# EAGLE design cemu-aux (EAGLE 5.07)
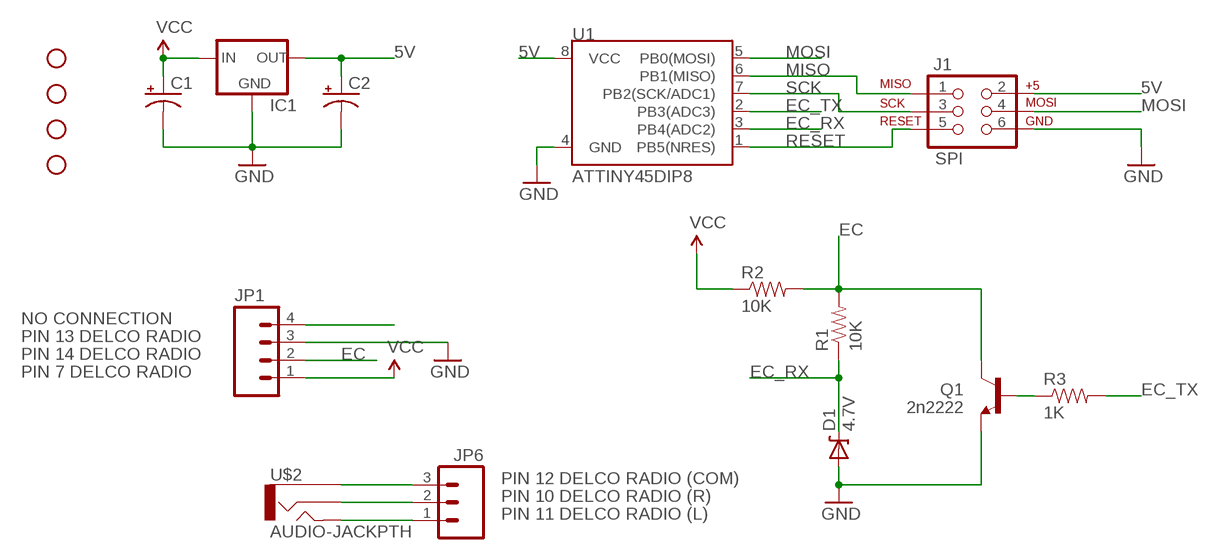
[diagram p0: schematic, sheet 1]

## Parts
C1  CAP_POLPTH1  [CPOL-RADIAL-100UF-25V]
C2  CAP_POLPTH1  [CPOL-RADIAL-100UF-25V]
D1  4.7V  DIODE-ZENERPTH  [DIODE-ZENER]
IC1  V_REG_78XXSIDE  [78XXL]
J1  SPI  AVR_SPI_PRG_6PTH  [2X3]
JP1  M04POLAR  [MOLEX-1X4]
JP2  STAND-OFF  [STAND-OFF]
JP3  STAND-OFF  [STAND-OFF]
JP4  STAND-OFF  [STAND-OFF]
JP5  STAND-OFF  [STAND-OFF]
JP6  M03POLAR  [MOLEX-1X3]
Q1  2n2222  TRANSISTOR_NPNTO92  [TO-92]
R1  10K  RESISTORPTH1  [AXIAL-0.3]
R2  10K  RESISTORPTH1  [AXIAL-0.3]
R3  1K  RESISTORPTH1  [AXIAL-0.3]
U1  ATTINY45DIP8  [DIP08]
U$2  AUDIO-JACKPTH  [AUDIO-JACK]

## Nets
5V: C2.1(+) IC1.OUT J1.2 U1.8(VCC)
EC: JP1.2 Q1.3(C) R1.P$2 R2.P$2
EC_RX: D1.P$1(C) R1.P$1 U1.3(PB4(ADC2))
EC_TX: R3.P$2 U1.2(PB3(ADC3))
GND: C1.2(-) C2.2(-) D1.P$2(A) IC1.GND J1.6 JP1.3 Q1.1(E) U1.4(GND)
MISO: J1.1 U1.6(PB1(MISO))
MOSI: J1.4 U1.5(PB0(MOSI))
N$1: JP6.3 U$2.1
N$3: JP6.2 U$2.2
N$4: JP6.1 U$2.5
N$10: Q1.2(B) R3.P$1
RESET: J1.5 U1.1(PB5(NRES))
SCK: J1.3 U1.7(PB2(SCK/ADC1))
VCC: C1.1(+) IC1.IN JP1.1 R2.P$1
Unconnected: JP1.4

## Notes on the sheet
- NO CONNECTION
- PIN 13 DELCO RADIO
- PIN 14 DELCO RADIO
- PIN 7 DELCO RADIO
- PIN 12 DELCO RADIO (COM)
- PIN 10 DELCO RADIO (R)
- PIN 11 DELCO RADIO (L)

## Library data of the parts
C1 C2 = SparkFun:CAP_POL: Capacitor Polarized These are standard SMD and PTH capacitors. Normally 10uF, 47uF, and 100uF in electrolytic and tantalum varieties. Always verify the external diameter of the through hole cap, it varies with capacity, voltage, and manufacturer. The EIA devices should be standard.
D1 = SparkFun:DIODE-ZENER: Zener Diode Production Part - 8199 3.4V Zener Voltage
IC1 = SparkFun:V_REG_78XX: Voltage Regulator Standard 7805 5V regulator. IGO (Input Ground Output). Spark Fun Electronics SKU : COM-00107
J1 = SparkFun:AVR_SPI_PRG_6: AVR ISP 6 Pin This is the reduced ISP connector for AVR programming. Common on Arduino. This footprint will take up less PCB space and can be used with a 10-pin to 6-pin adapter such as SKU: BOB-08508
JP1 = SparkFun:M04: Header 4 Standard 4-pin 0.1" header. Use with straight break away headers (SKU : PRT-00116), right angle break away headers (PRT-00553), swiss pins (PRT-00743), machine pins (PRT-00117), and female headers (PRT-00115). Molex polarized connector foot print use with SKU : PRT-08231 with associated crimp pins and housings.
JP2-JP5 = SparkFun:STAND-OFF: Stand Off This is the mechanical footprint for a #4 phillips button head screw. Use the keepout ring to avoid running the screw head into surrounding components. SKU : PRT-00447
JP6 = SparkFun:M03: Header 3 Standard 3-pin 0.1" header. Use with straight break away headers (SKU : PRT-00116), right angle break away headers (PRT-00553), swiss pins (PRT-00743), machine pins (PRT-00117), and female headers (PRT-00115). Molex polarized connector foot print use with SKU : PRT-08232 with associated crimp pins and housings.
Q1 = SparkFun:TRANSISTOR_NPN: Transistor NPN BJT configuration in SOT23 package. MMBT2222 is the common NPN we use. Double check BCE configuration again layout.
R1-R3 = SparkFun:RESISTOR: Resistor Basic schematic elements and footprints for 0603, 1206, and PTH 1/10th watt (small) resistors.
U1 = SparkFun:ATTINY45: Atmel ATTiny45
U$2 = SparkFun:AUDIO-JACK: 3.5mm Audio Jack Simple 3.5mm common PCB mount audio jack. SKU: PRT-08032

## Board
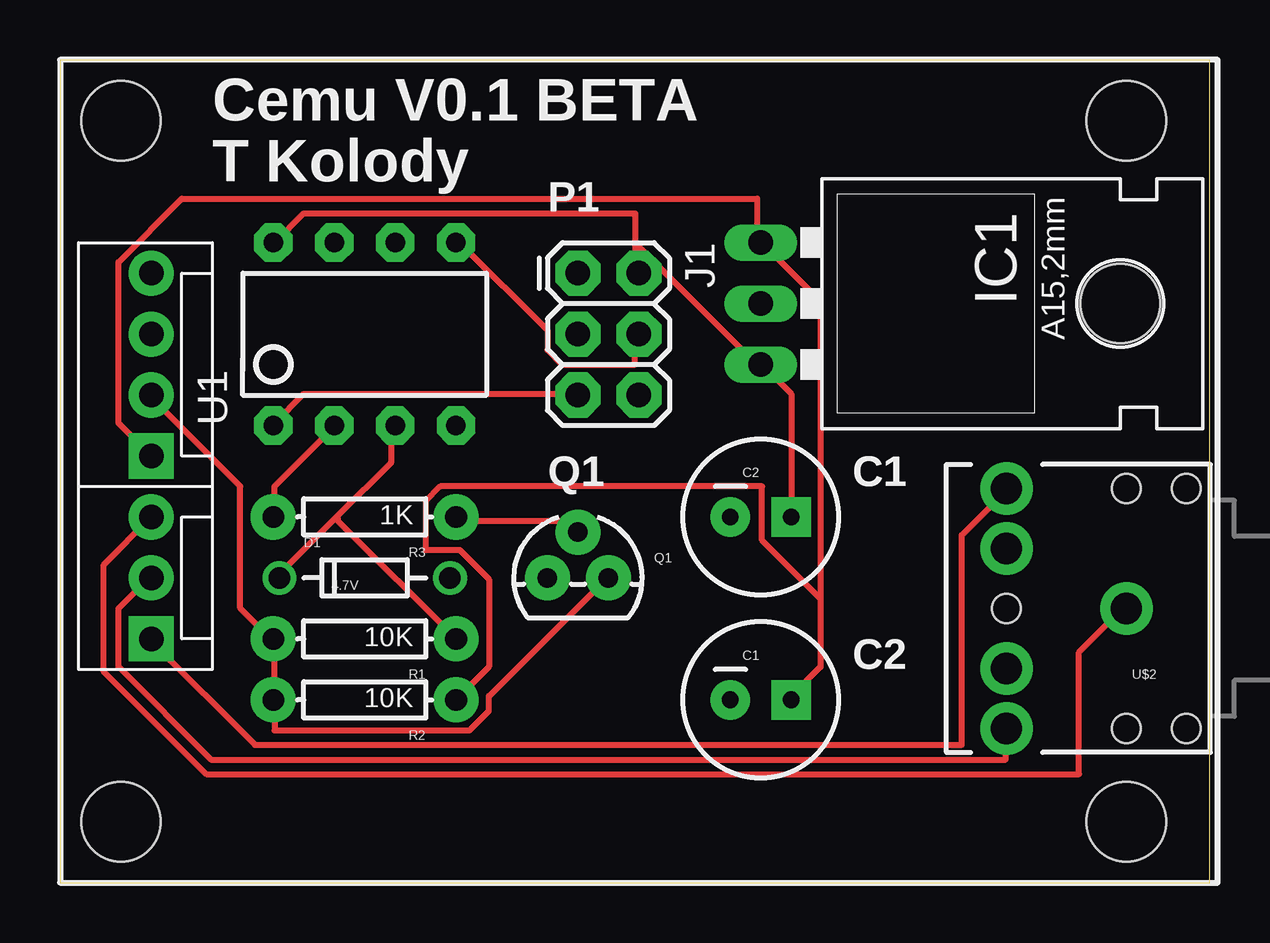
[diagram p1: board, top side]
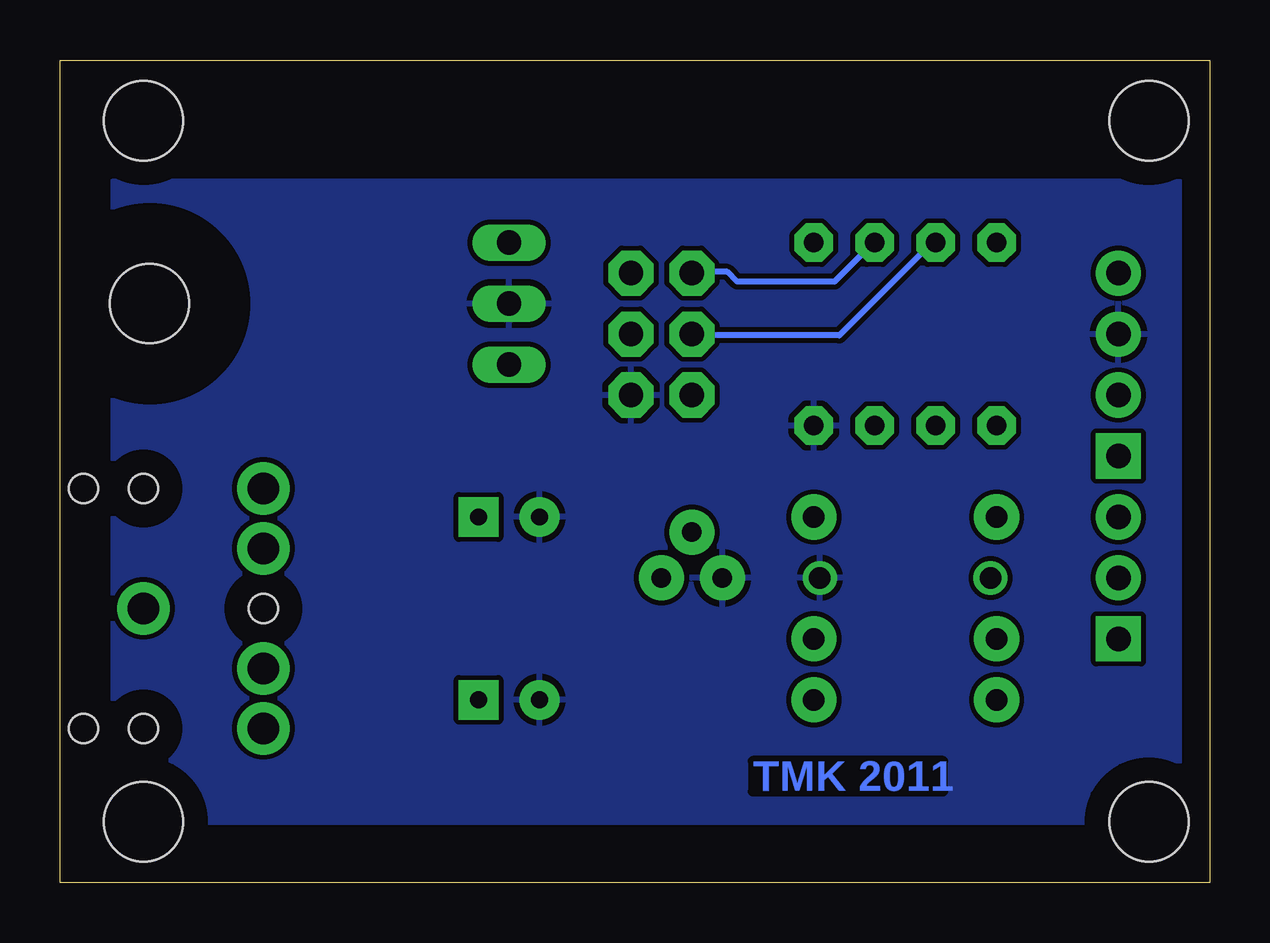
[diagram p2: board, bottom side, seen from below]

Size 47.93 x 34.28 mm. Coordinates in mm from the lower left corner, seen from the top.
Outline: 0,0 47.93,0 47.93,34.28 0,34.28 0,0
Copper layers (1*16): Top 0.035mm / dielectric 1.5mm / Bottom 0.035mm
Design rules "default": minimum track width 10mil, minimum drill 24mil, track to track 8mil, track to pad 8mil, pad to pad 8mil, via to via 8mil, smd to smd 8mil, copper to edge 40mil, drill to drill 8mil, minimum pad ring 10mil, minimum via ring 8mil, stop-mask expansion 4mil, vias tented up to drill 0mil, thermal gap 10mil

### Footprints (pad centres in the part's own frame; a part is rotated, then mirrored left to right if it is on the bottom)
CPOL-RADIAL-100UF-25V = drill 0.7 pad 1.651 square: 1 1.27,0 | drill 0.7 pad 1.651 round: 2 -1.27,0
DIODE-ZENER = drill 0.9 round: P$1 -3.556,0; P$2 3.556,0
78XXL = drill 1.016 long: GND 0,-3.81; IN -2.54,-3.81; OUT 2.54,-3.81 | hole 3.302: 0,11.176
2X3 = drill 1.016 pad 1.88 octagon: 1 0,0; 2 0,2.54; 3 2.54,0; 4 2.54,2.54; 5 5.08,0; 6 5.08,2.54
MOLEX-1X4 = drill 1.016 pad 1.88 square: 1 0,0 | drill 1.016 pad 1.88 round: 2 2.54,0; 3 5.08,0; 4 7.62,0
STAND-OFF = hole 3.302: 0,0
MOLEX-1X3 = drill 1.016 pad 1.88 square: 1 0,0 | drill 1.016 pad 1.88 round: 2 2.54,0; 3 5.08,0
TO-92 = drill 0.813 pad 1.88 round: 1 -1.27,0; 2 0,1.905; 3 1.27,0
AXIAL-0.3 = drill 0.9 pad 1.88 round: P$1 -3.81,0; P$2 3.81,0
DIP08 = drill 0.813 pad 1.6 octagon: 1 -3.81,-3.81; 2 -1.27,-3.81; 3 1.27,-3.81; 4 3.81,-3.81; 5 3.81,3.81; 6 1.27,3.81; 7 -1.27,3.81; 8 -3.81,3.81
AUDIO-JACK = drill 1.3 pad 2.184 round: 1 0,0; 2 5,5; 3 5,2.5; 4 5,-2.5; 5 5,-5 | hole 1.2: 0,5; -2.5,5; -2.5,-5; 0,-5; 5,0

### Placement (x,y rotation side)
C1  29.21,7.62 0 top
C2  29.21,15.24 0 top
D1  12.7,12.7 0 top
IC1  33.02,24.13 270 top
J1  21.59,25.4 270 top
JP1  3.81,17.78 90 top
JP2  2.54,31.75 0 top
JP3  44.45,2.54 0 top
JP4  44.45,31.75 0 top
JP5  2.54,2.54 0 top
JP6  3.81,10.16 90 top
Q1  21.59,12.7 0 top
R1  12.7,10.16 180 top
R2  12.7,7.62 180 top
R3  12.7,15.24 180 top
U1  12.7,22.86 0 top
U$2  44.45,11.43 180 top

### Tracks (layer width: path | path; a pad name or v marks a point on that pad's centre or on a via)
5V
  Top 0.254: C2.1 30.48,20.37 29.26,21.59 IC1.OUT 29.06,21.59 23.98,26.67 | 23.98,26.67 23.98,25.45 J1.2 | 23.98,26.67 23.98,27.89 10.16,27.89 8.94,26.67 U1.8
EC
  Top 0.254: JP1.2 3.86,20.17 7.52,16.51 7.52,11.43 8.74,10.21 R1.P$2 8.94,10.01 8.94,7.77 R2.P$2 8.94,7.57 8.94,6.35 17.07,6.35 17.88,7.16 17.88,7.77 22.76,12.65 Q1.3
EC_RX
  Top 0.254: 11.58,15.29 13.82,17.53 13.82,18.95 U1.3 | 11.58,15.29 9.14,12.85 D1.P$1 | 11.58,15.29 11.58,15.09 R1.P$1
EC_TX
  Top 0.254: U1.2 11.38,18.95 8.94,16.51 8.94,15.29 R3.P$2
GND
  pour Bottom: 1.27,29.21 45.72,29.21 45.72,5.08 43.18,5.08 41.91,3.81 41.91,2.54 5.08,2.54 5.08,3.81 3.81,5.08 1.27,5.08
MISO
  Bottom 0.254: U1.6 14.02,26.67 15.65,25.04 19.71,25.04 20.12,25.45 21.54,25.45 J1.1
MOSI
  Top 0.254: U1.5 16.66,26.67 20.32,23.01 20.32,22.2 20.93,21.59 23.98,21.59 23.98,22.81 J1.4
N$1
  Top 0.254: JP6.3 1.83,13.26 1.83,8.79 6.1,4.52 42.47,4.52 42.47,9.6 44.3,11.43 U$2.1
N$3
  Top 0.254: JP6.2 3.66,12.65 2.44,11.43 2.44,8.99 6.3,5.13 39.42,5.13 39.42,6.35 U$2.2
N$4
  Top 0.254: JP6.1 3.86,10.01 8.13,5.74 37.59,5.74 37.59,14.48 39.42,16.31 U$2.5
N$10
  Top 0.254: R3.P$1 16.66,15.09 21.54,15.09 21.54,14.68 Q1.2
RESET
  Top 0.254: U1.1 8.94,19.15 10.16,20.37 21.54,20.37 J1.5
SCK
  Bottom 0.254: U1.7 11.58,26.67 15.44,22.81 21.54,22.81 J1.3
VCC
  Top 0.254: 31.7,11.84 31.7,8.99 30.48,7.77 C1.1 | 31.7,11.84 31.7,24.23 29.26,26.67 IC1.IN 29.06,26.67 29.06,28.5 5.08,28.5 2.44,25.86 2.44,19.15 JP1.1 | 31.7,11.84 29.26,14.28 29.26,16.51 15.85,16.51 15.24,15.9 15.24,13.87 16.66,13.87 17.88,12.65 17.88,8.99 R2.P$1

### Text on the board
Bottom: TMK 2011
tPlace: Cemu V0.1 BETA | T Kolody | P1 | Q1 | C1 | C1 | C2